# EAGLE design 24x16_RGB_Bottom (EAGLE 6.5.0)

## Sheet 1 of 2
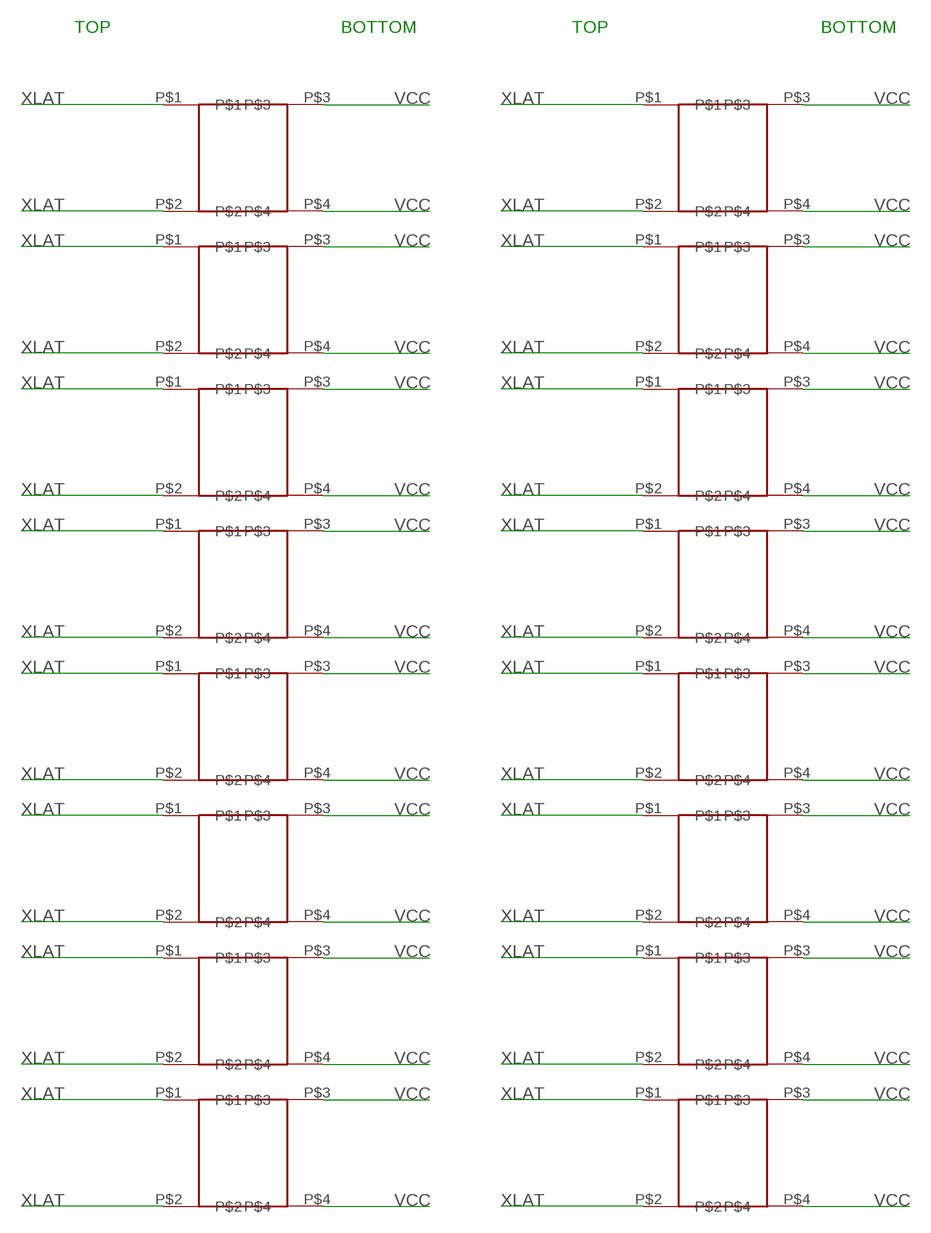
[diagram p0: schematic, sheet 1]

### Parts
SLOT1  SLOT  [SLOT]
SLOT2  SLOT  [SLOT]
SLOT3  SLOT  [SLOT]
SLOT4  SLOT  [SLOT]
SLOT5  SLOT  [SLOT]
SLOT6  SLOT  [SLOT]
SLOT7  SLOT  [SLOT]
SLOT8  SLOT  [SLOT]
SLOT9  SLOT  [SLOT]
SLOT10  SLOT  [SLOT]
SLOT11  SLOT  [SLOT]
SLOT12  SLOT  [SLOT]
SLOT13  SLOT  [SLOT]
SLOT14  SLOT  [SLOT]
SLOT15  SLOT  [SLOT]
SLOT16  SLOT  [SLOT]

### Nets
VCC: SLOT1.P$3 SLOT1.P$4 SLOT2.P$3 SLOT2.P$4 SLOT3.P$3 SLOT3.P$4 SLOT4.P$3 SLOT4.P$4 SLOT5.P$3 SLOT5.P$4 SLOT6.P$3 SLOT6.P$4 SLOT7.P$3 SLOT7.P$4 SLOT8.P$3 SLOT8.P$4 SLOT9.P$3 SLOT9.P$4 SLOT10.P$3 SLOT10.P$4 SLOT11.P$3 SLOT11.P$4 SLOT12.P$3 SLOT12.P$4 SLOT13.P$3 SLOT13.P$4 SLOT14.P$3 SLOT14.P$4 SLOT15.P$3 SLOT15.P$4 SLOT16.P$3 SLOT16.P$4
XLAT: SLOT1.P$1 SLOT1.P$2 SLOT2.P$1 SLOT2.P$2 SLOT3.P$1 SLOT3.P$2 SLOT4.P$1 SLOT4.P$2 SLOT5.P$1 SLOT5.P$2 SLOT6.P$1 SLOT6.P$2 SLOT7.P$1 SLOT7.P$2 SLOT8.P$1 SLOT8.P$2 SLOT9.P$1 SLOT9.P$2 SLOT10.P$1 SLOT10.P$2 SLOT11.P$1 SLOT11.P$2 SLOT12.P$1 SLOT12.P$2 SLOT13.P$1 SLOT13.P$2 SLOT14.P$1 SLOT14.P$2 SLOT15.P$1 SLOT15.P$2 SLOT16.P$1 SLOT16.P$2

### Notes on the sheet
- TOP | BOTTOM | TOP | BOTTOM

## Sheet 2 of 2
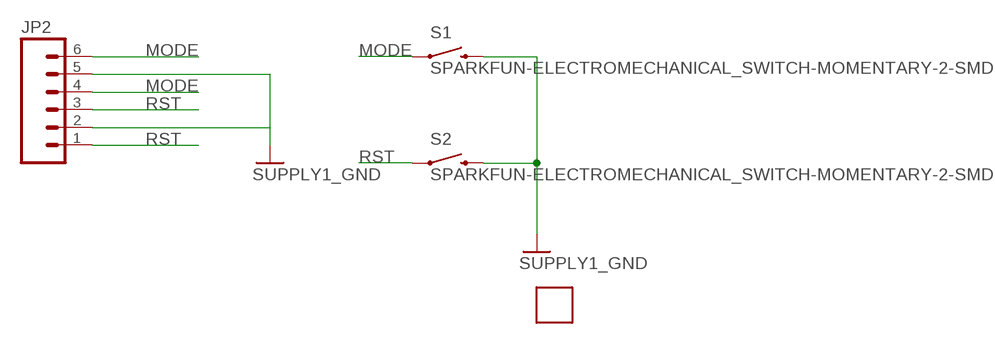
[diagram p1: schematic, sheet 2]

### Parts
JP2  M06SIP  [1X06]
S1  SPARKFUN-ELECTROMECHANICAL_SWITCH-MOMENTARY-2-SMD-1101NE  [SPARKFUN-ELECTROMECHANICAL_TACTILE-SWITCH-1101NE]
S2  SPARKFUN-ELECTROMECHANICAL_SWITCH-MOMENTARY-2-SMD-1101NE  [SPARKFUN-ELECTROMECHANICAL_TACTILE-SWITCH-1101NE]
U$1  DC_PWR  [DC_2.1]

### Nets
GND: JP2.2 JP2.5 S1.P$2 S2.P$2 ; supply symbol labelled SUPPLY1_GND
MODE: JP2.4 JP2.6 S1.P$1
RST: JP2.1 JP2.3 S2.P$1

## Library data of the parts
JP2 = SparkFun-Connectors:M06: Header 6 Standard 6-pin 0.1" header. Use with straight break away headers (SKU : PRT-00116), right angle break away headers (PRT-00553), swiss pins (PRT-00743), machine pins (PRT-00117), and female headers (PRT-00115). Molex polarized connector foot print use with SKU : PRT-08094 with associated crimp pins and housings. NOTES ON THE VARIANTS LOCK and LOCK_LONGPADS... This footprint was designed to help hold the alignment of a through-hole component (i.e. 6-pin header) while soldering it into place. You may notice that each hole has been shifted either up or down by 0.005 of an inch from it's more standard position (which is a perfectly straight line). This slight alteration caused the pins (the squares in the middle) to touch the edges of the holes. Because they are alternating, it causes a "brace" to hold the component in place. 0.005 has proven to be the perfect amount of "off-center" position when using our standard breakaway headers. Although looks a little odd when you look at the bare footprint, once you have a header in there, the alteration is very hard to notice. Also,if you push a header all the way into place, it is covered up entirely on the bottom side. This idea of altering the position of holes to aid alignment will be further integrated into the Sparkfun Library for other footprints. It can help hold any component with 3 or more connection pins.
S1 S2 = tvbgone-2layer:SPARKFUN-ELECTROMECHANICAL_SWITCH-MOMENTARY-2: Various NO switches- pushbuttons, reed, etc
SLOT1-SLOT16 = 24x16_RGB_Bottom:SLOT; OC_NEWARK: unknown
U$1 = 24x16_RGB_Bottom:DC_PWR

## Board
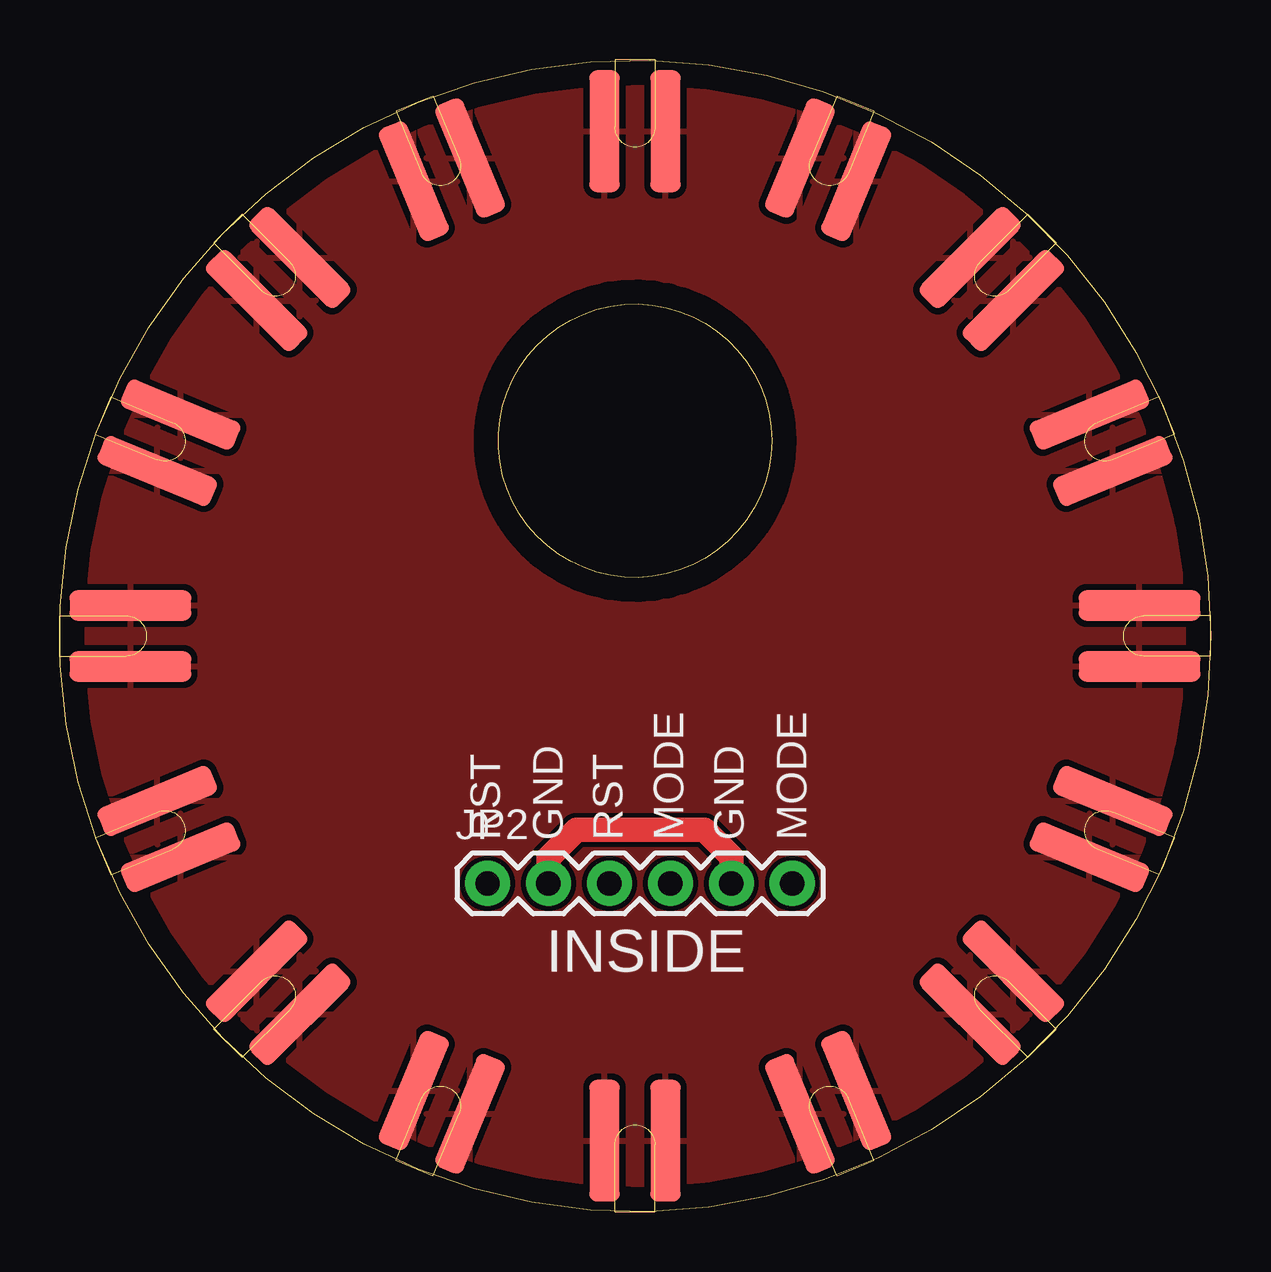
[diagram p2: board, top side]
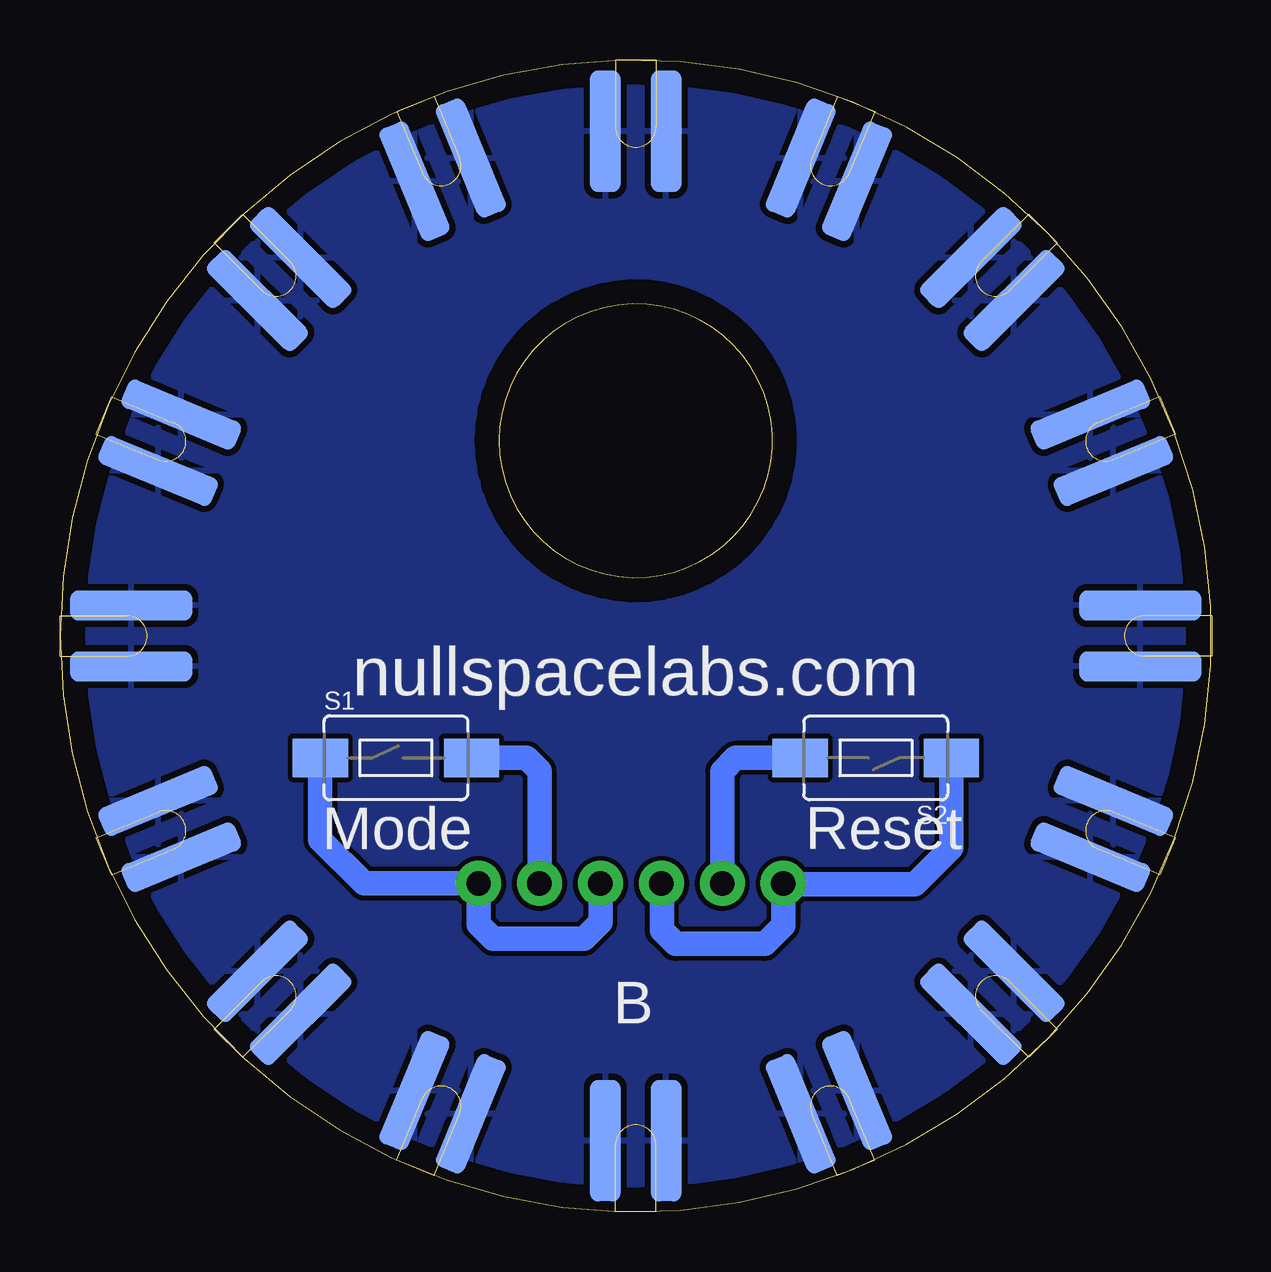
[diagram p3: board, bottom side, seen from below]

Size 47.97 x 47.98 mm. Coordinates in mm from the lower left corner, seen from the top.
Outline: 47.97,23.99 arc-360 47.97,24
Copper layers (1*16): Top 0.035mm / dielectric 1.5mm / Bottom 0.035mm
Design rules "default": minimum track width 10mil, minimum drill 24mil, track to track 8mil, track to pad 8mil, pad to pad 8mil, via to via 8mil, smd to smd 8mil, copper to edge 40mil, drill to drill 8mil, minimum pad ring 10mil, minimum via ring 8mil, stop-mask expansion 4mil, vias tented up to drill 0mil, thermal gap 10mil

### Footprints (pad centres in the part's own frame; a part is rotated, then mirrored left to right if it is on the bottom)
1X06 = drill 1.016 pad 1.88: 1 0,0; 2 2.54,0; 3 5.08,0; 4 7.62,0; 5 10.16,0; 6 12.7,0
SPARKFUN-ELECTROMECHANICAL_TACTILE-SWITCH-1101NE = smd 2.3 x 1.6: P$1 -3.15,0; P$2 3.15,0
SLOT = smd 5.08 x 1.27: P$1 2.972,1.27; P$2 2.972,-1.27 | smd 5.08 x 1.27 bottom: P$3 2.972,1.27; P$4 2.972,-1.27

### Placement (x,y rotation side)
JP2  17.82,13.67 0 top
S1  33.97,18.91 0 bottom
S2  13.97,18.91 180 bottom
SLOT1  47.97,23.99 180 top
SLOT2  46.14,33.17 202.5 top
SLOT3  40.94,40.96 225 top
SLOT4  33.15,46.16 247.5 top
SLOT5  23.97,47.99 270 top
SLOT6  14.78,46.16 292.5 top
SLOT7  7,40.96 315 top
SLOT8  1.8,33.17 337.5 top
SLOT9  -0.03,23.99 0 top
SLOT10  1.8,14.8 22.5 top
SLOT11  7,7.02 45 top
SLOT12  14.78,1.81 67.5 top
SLOT13  23.97,-0.01 90 top
SLOT14  33.15,1.81 112.5 top
SLOT15  40.94,7.02 135 top
SLOT16  46.14,14.8 157.5 top
U$1  23.97,32.12 0 top

### Tracks (layer width: path | path; a pad name or v marks a point on that pad's centre or on a via)
GND
  Top 1.016: JP2.2 20.36,14.74 21.53,15.91 26.86,15.91 27.98,14.79 JP2.5
  Bottom 1.016: S1.P$2 28.52,18.91 27.98,18.37 JP2.5 | S2.P$2 19.8,18.91 20.36,18.35 JP2.2
MODE
  Bottom 1.016: S1.P$1 37.12,15.5 35.3,13.68 JP2.6 30.52,11.97 29.91,11.36 26.13,11.36 25.44,12.05 JP2.4
RST
  Bottom 1.016: S2.P$1 10.82,15.17 12.34,13.65 17.8,13.65 JP2.1 17.82,11.92 18.58,11.16 22.32,11.16 22.88,11.72 22.88,13.65 JP2.3
VCC
  pour Bottom: -2.5,51.07 -2.5,-3.53 50.67,-2.98 50.67,51.62
XLAT
  pour Top: 50.3,50.59 50.91,-3.16 -2.07,-2.37 -2.53,50.06

### Text on the board
tPlace: RST | GND | RST | MODE | GND | MODE | INSIDE
bPlace: nullspacelabs.com | Reset | Mode | B